# Altium schematic sheet Ancillaries.SchDoc
size A3; SheetNumber: 3; SheetTotal: 5
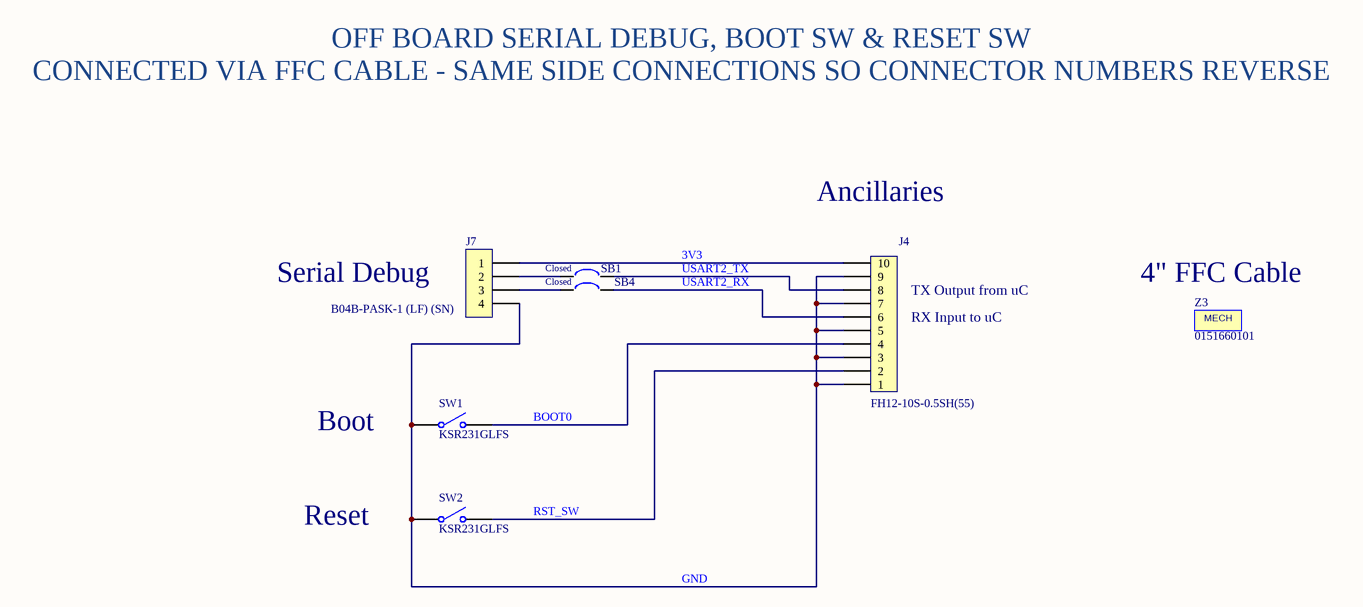
[diagram p0: Ancillaries.SchDoc]

## Parts
J4  Ancillaries  ManuPartNo: FH12-10S-0.5SH(55)  [FH12-10S-0_5SH]
J7  Serial Debug  ManuPartNo: B04B-PASK-1 (LF) (SN)  [B04B-PASK-1]
SB1  Solder Blob Closed  [0603SolderLinkClosed]  (value not drawn)  (no BOM)
SB4  Solder Blob Closed  [0603SolderLinkClosed]  (value not drawn)  (no BOM)
SW1  Boot  ManuPartNo: KSR231GLFS  [SW_KSR]
SW2  Reset  ManuPartNo: KSR231GLFS  [SW_KSR]
Z3  4" FFC Cable  ManuPartNo: 0151660101  (mechanical)

## Nets
NetJ4_1: J4.1 J4.3 J4.5 J4.7 J4.9 J7.4 SW1.1(COMMON) SW2.1(COMMON)
NetJ4_2: J4.2 SW2.2(NO)
NetJ4_4: J4.4 SW1.2(NO)
NetJ4_6: J4.6 SB4.2
NetJ4_8: J4.8 SB1.2
NetJ4_10: J4.10 J7.1
NetJ7_2: J7.2 SB1.1
NetJ7_3: J7.3 SB4.1

## Notes on the sheet
- OFF BOARD SERIAL DEBUG, BOOT SW & RESET SW
  CONNECTED VIA FFC CABLE - SAME SIDE CONNECTIONS SO CONNECTOR NUMBERS REVERSE
- 3V3
- USART2_TX
- USART2_RX
- (near J4) TX Output from uC
- (near J4) RX Input to uC
- BOOT0
- RST_SW
- GND
- ©
- CAD:
- Altium Designer
- Changed by:
- Drawing No:
- Change date:
- Title:
- Sub-Title:
- Project Sunride
  The Diamond
  32 Leavygreave Rd
  Broomhall, Sheffield
  United Kingdom
  S3 7RD
- THIS DRAWING REMAINS THE PROPERTY OF PROJECT SUNRIDE.
  COPYRIGHT FOR ALL PURPOSES IS VESTED IN PROJECT SUNRIDE.
  THE REPRODUCTION OF THIS DRAWING IN WHOLE OR IN PART IS PROHIBITED WITHOUT EXPRESS CONSENT IN WRITING. THIS DESIGN IS OFFERED FOR USE ONLY WITH EQUIPMENT MANUFACTURED OR SPECIFICALLY RECOMMENDED BY PROJECT SUNRIDE. RIGHTS ARE RESERVED TO MAKE A CHARGE FOR THE USE OF THIS DESIGN OR ANY PART THEREOF AND SUCH RIGHT SHALL SUBSIST UNLESS AND UNTIL THE SAME SHALL BE EXPRESSLY WAIVED IN WRITING. ACCEPTANCE OF THIS DRAWING WILL BE CONSTRUED AS AN ACCEPTANCE OF THESE CONDITIONS.
- Size:
- A3
- Change reason:
- Sheet
- of
- Variant:
- (in symbol Solder Blob Closed) Closed

## Library data of the parts
J4 = FEC1324540: Connector 10W FFC/FPC 0.5mm SM ZIF; Manufacturer: Hirose; Orient: Horizontal; Cost 1+: 1.02; Cost 1K+: 0.563; Life: V; Source: FEC1324540; Pin Count: 10; Supplier 1: Farnell; Supplier Part Number 1: 1324540; Class: Connector; RoHS: Y; Created: 28/02/2020; Last_Updated: 28/02/2020; ComponentLink1Description: Datasheet; ComponentLink1URL: C:\Altium SANDBOX\Component Database\Datasheet\Hirose FH12 Series.pdf
J7 = RS512-8608: Connector 4 Way Vertical JST B04B-PASK-1 (LF) (SN) 2mm Pitch; Cost 1+: 0.26; Cost 1K+: 0.24; Life: V; Source: RS512-8608; Pin Count: 4; Orient: Vertical; Manufacturer: JST; Supplier 1: RSComponents; Supplier Part Number 1: 512-8608; Pitch: 2mm; Class: Connector; RoHS: Y; Created: 05/06/2013; Last_Updated: 05/06/2013
SB1 SB4 = Solder Blob Closed: Solder Blob - Closed 0603 SM pads; Life: V; Source: Solder Blob Closed; Pin Count: 2; RoHS: Y; Created: 13/10/2017; Last_Updated: 13/10/2017
SW1 SW2 = FEC120-1422: Switch SMD SPST-NO Vertical ITT/Cannon KSR231GLFS; Cost 1+: 0.77; Cost 1K+: 0.54; Life: V; Source: FEC120-1422; Switch Type: SPST-NO; Orient: Vertical; Manufacturer: ITT/Cannon; Supplier 1: Farnell; Supplier Part Number 1: 1201422; Class: Switch SMD; RoHS: Y; Created: 18/09/2013; Last_Updated: 18/09/2013
Z3 = DigiKeyWM11300-ND: CABLE FFC/FPC 10POS 0.5MM 4"; Manufacturer: Molex; Cost 1+: 1.67; Cost 1K+: 1.26; Life: V; Source: DigiKeyWM11300-ND; Supplier 1: Digi-Key; Supplier Part Number 1: WM11300-ND; RoHS: Y; Created: 02/11/2025; Last_Updated: 02/11/2025; ComponentLink1Description: Datasheet; ComponentLink1URL: C:\Altium SANDBOX\Component Database\Datasheet\PS-15166-001-001.pdf